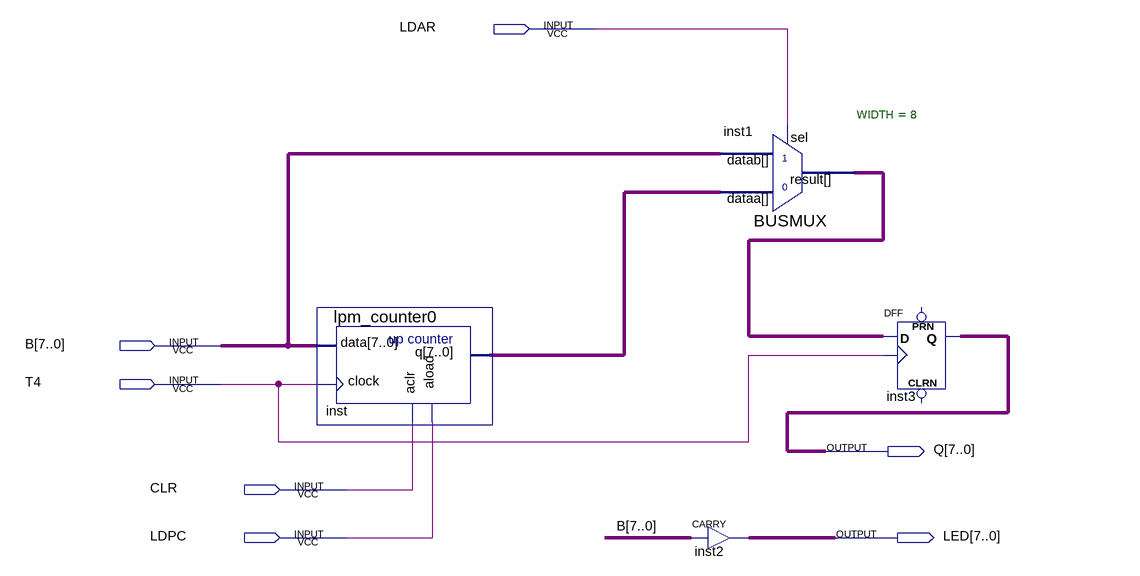
[diagram p0: schematic sheet]
// Quartus schematic PC.bdf as structural Verilog: 4 symbols, 7 pins
module PC (
  input  LDAR,
  input  [7:0] B,
  input  T4,
  input  CLR,
  input  LDPC,
  output [7:0] Q,
  output [7:0] LED
);

  wire [7:0] inst1_result, inst_q;

  lpm_counter0 inst (.data(B), .clock(T4), .aclr(CLR), .aload(LDPC), .q(inst_q));
  BUSMUX #(.WIDTH(8)) inst1 (.datab(B), .sel(LDAR), .dataa(inst_q), .result(inst1_result));
  CARRY inst2[7:0] (.IN(B), .OUT(LED));
  DFF inst3[7:0] (.CLK(T4), .D(inst1_result), .Q(Q));  // open: CLRN, PRN
endmodule
